# Altium project CopterControl.PrjPCB
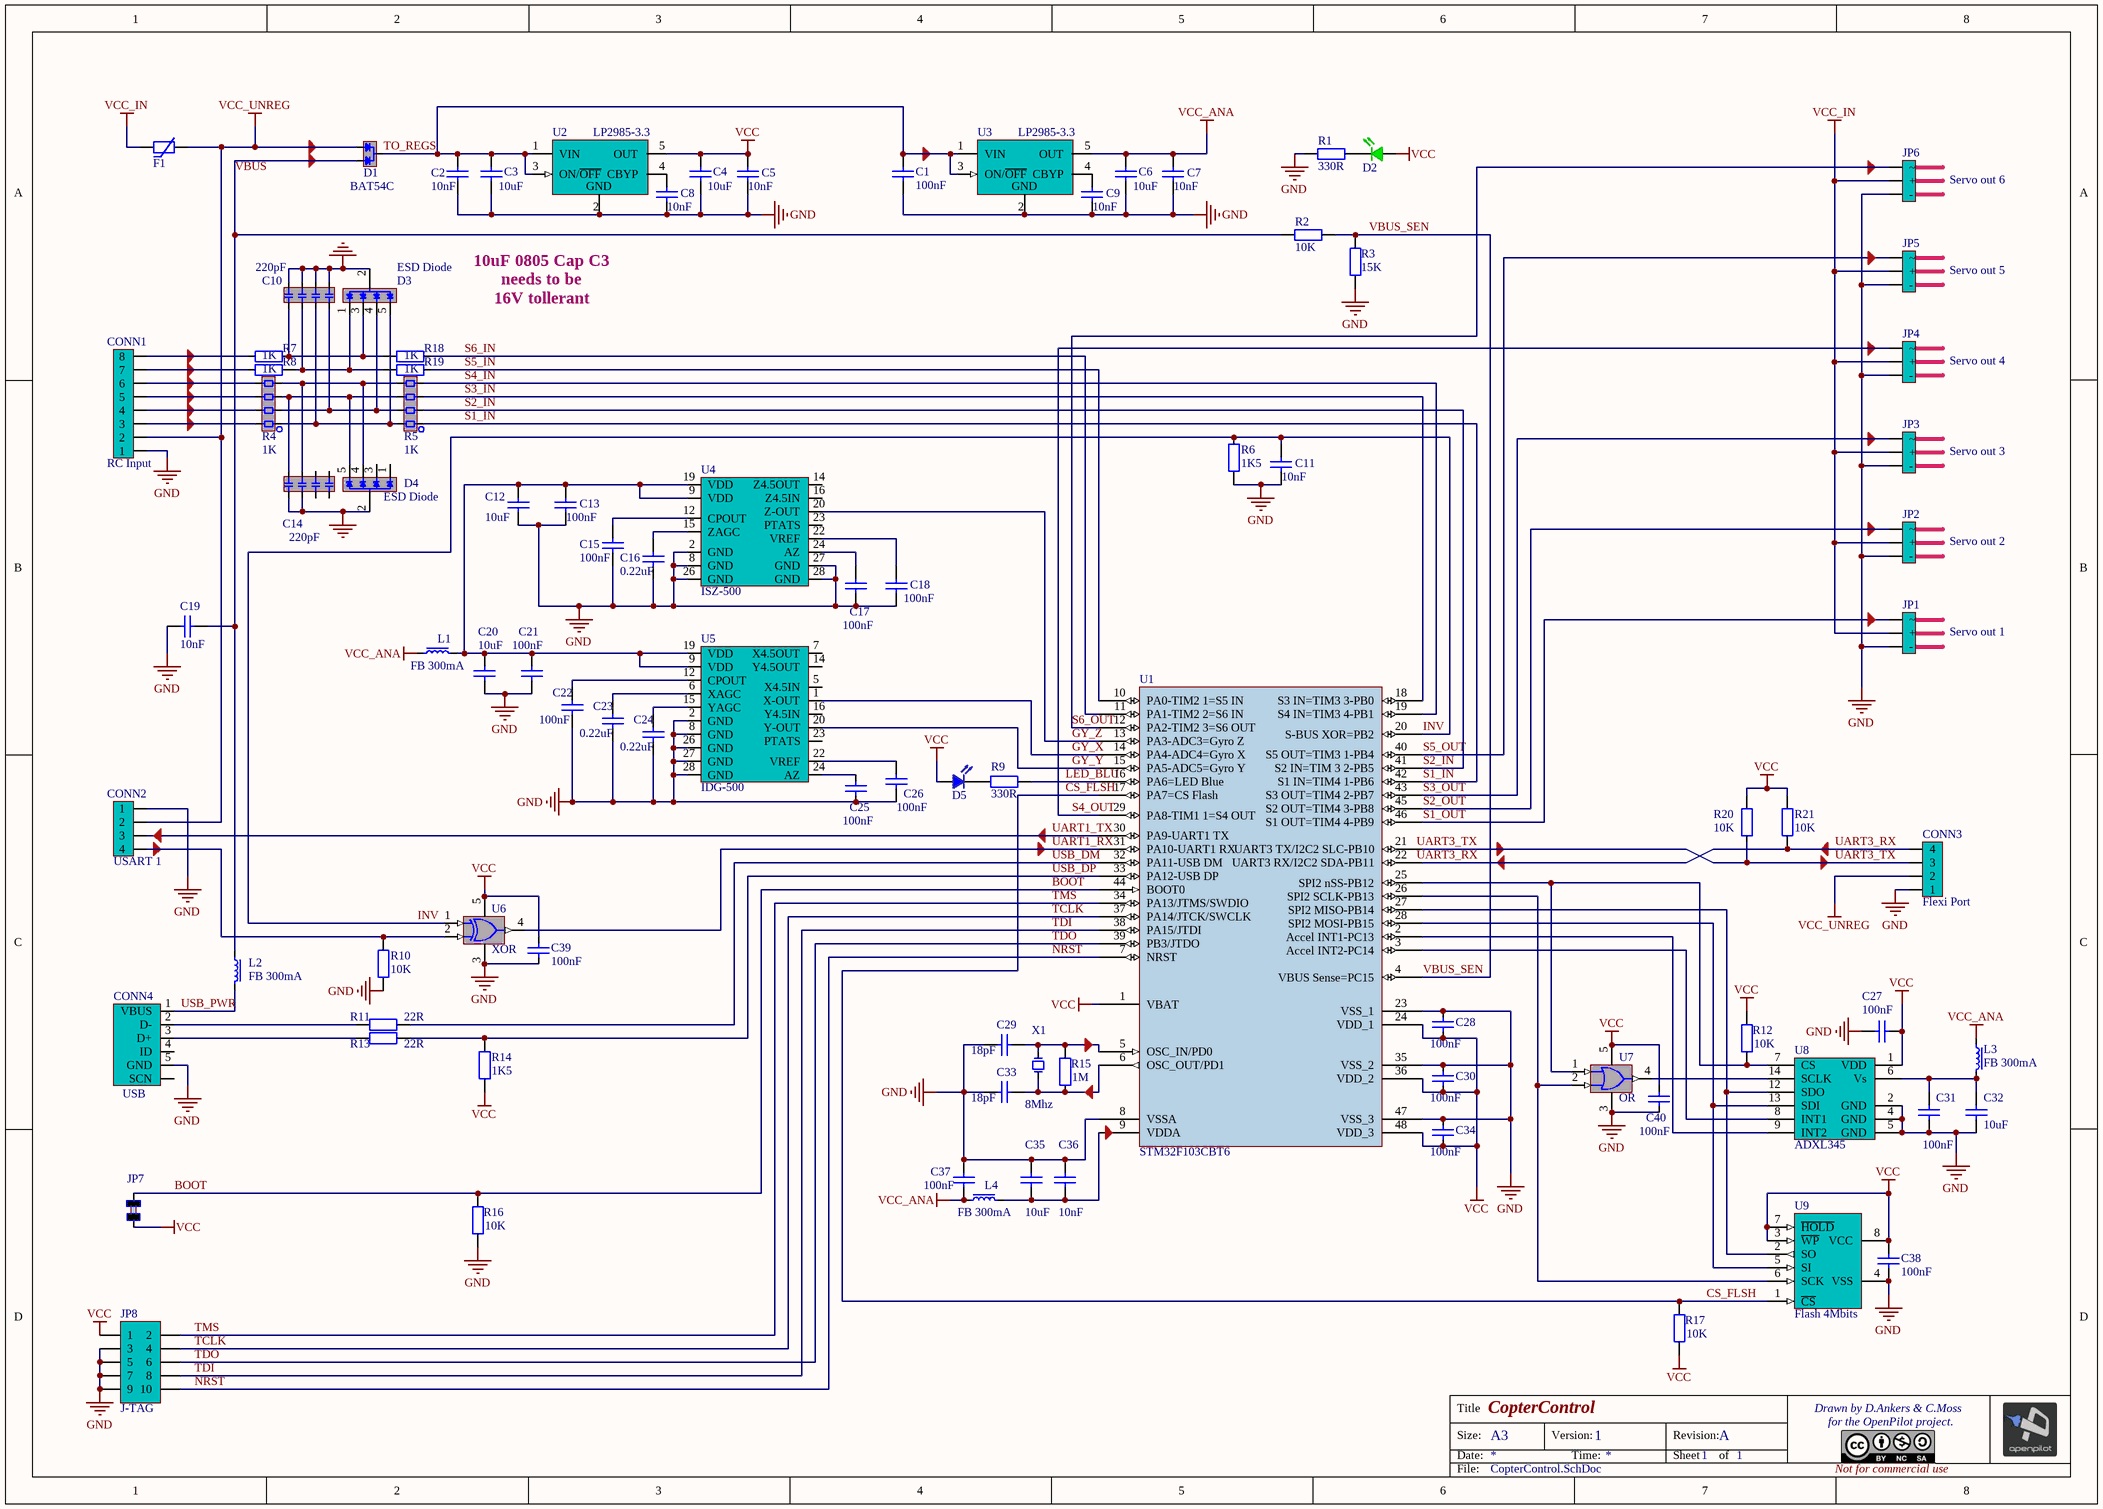
[diagram p0: CopterControl.SchDoc]
1 sheet, 93 parts. Net scope: global (net labels, ports and power ports of the same name join across sheets).
Board file: CopterControl.PcbDoc

## Sheet CopterControl.SchDoc: CopterControl
size A3; Author: David Ankers; DrawnBy: David Ankers; Engineer: David Ankers; Organization: The OpenPilot Project; DocumentNumber: 1; Revision: A; SheetNumber: 1; SheetTotal: 1; License: Creative Commons BY-NC-SA Non commercial use only; ProjectName: OpenPilot

### Parts
C1  value 100nF  [CAP603N]  (hidden comment: Cap603)
C2  value 10nF  [CAP603N]  (hidden comment: Cap603)
C3  value 10uF  [CAP805N]  (hidden comment: Cap805)
C4  value 10uF  [CAP805N]  (hidden comment: Cap805)
C5  value 10nF  [CAP603N]  (hidden comment: Cap603)
C6  value 10uF  [CAP805N]  (hidden comment: Cap805)
C7  value 10nF  [CAP603N]  (hidden comment: Cap603)
C8  value 10nF  [CAP603N]  (hidden comment: Cap603)
C9  value 10nF  [CAP603N]  (hidden comment: Cap603)
C10  value 220pF  [CAP ARRAY 0612]  (hidden comment: Cap Array 220pF)
C11  value 10nF  [CAP603N]  (hidden comment: Cap603)
C12  value 10uF  [CAP805N]  (hidden comment: Cap805)
C13  value 100nF  [CAP603N]  (hidden comment: Cap603)
C14  value 220pF  [CAP ARRAY 0612]  (hidden comment: Cap Array 220pF)
C15  value 100nF  [CAP603N]  (hidden comment: Cap603)
C16  value 0.22uF  [CAP603N]  (hidden comment: Cap603)
C17  value 100nF  [CAP603N]  (hidden comment: Cap603)
C18  value 100nF  [CAP603N]  (hidden comment: Cap603)
C19  value 10nF  [CAP603N]  (hidden comment: Cap603)
C20  value 10uF  [CAP805N]  (hidden comment: Cap805)
C21  value 100nF  [CAP603N]  (hidden comment: Cap603)
C22  value 100nF  [CAP603N]  (hidden comment: Cap603)
C23  value 0.22uF  [CAP603N]  (hidden comment: Cap603)
C24  value 0.22uF  [CAP603N]  (hidden comment: Cap603)
C25  value 100nF  [CAP603N]  (hidden comment: Cap603)
C26  value 100nF  [CAP603N]  (hidden comment: Cap603)
C27  value 100nF  [CAP603N]  (hidden comment: Cap603)
C28  value 100nF  [CAP603N]  (hidden comment: Cap603)
C29  value 18pF  [CAP603N]  (hidden comment: Cap603)
C30  value 100nF  [CAP603N]  (hidden comment: Cap603)
C31  value 100nF  [CAP603N]  (hidden comment: Cap603)
C32  value 10uF  [CAP805N]  (hidden comment: Cap805)
C33  value 18pF  [CAP603N]  (hidden comment: Cap603)
C34  value 100nF  [CAP603N]  (hidden comment: Cap603)
C35  value 10uF  [CAP805N]  (hidden comment: Cap805)
C36  value 10nF  [CAP603N]  (hidden comment: Cap603)
C37  value 100nF  [CAP603N]  (hidden comment: Cap603)
C38  value 100nF  [CAP603N]  (hidden comment: Cap603)
C39  value 100nF  [CAP603N]  (hidden comment: Cap603)
C40  value 100nF  [CAP603N]  (hidden comment: Cap603)
CONN1  RC Input  [JST SH 8 Pin Side Entry]
CONN2  USART 1  [JST SH 4 Pin Side Entry]
CONN3  Flexi Port  [JST SH 4 Pin Side Entry]
CONN4  USB  [USB SMD]
D1  BAT54C  [SOT23-3N]
D2  Green  [LED603N]  (value not drawn)
D3  ESD Diode  [SOT-353]
D4  ESD Diode  [SOT-353]
D5  Blue  [LED603N]  (value not drawn)
F1  MF-MSMF030-2  [PTC1812N]  (value not drawn)
JP1  Servo out 1  [SIP3 - 0.1]
JP2  Servo out 2  [SIP3 - 0.1]
JP3  Servo out 3  [SIP3 - 0.1]
JP4  Servo out 4  [SIP3 - 0.1]
JP5  Servo out 5  [SIP3 - 0.1]
JP6  Servo out 6  [SIP3 - 0.1]
JP7  2 PAD Touch JMP  [TOUCH JMP 2PAD - duplicate]  (value not drawn)
JP8  J-TAG  [JTAG Hdr 10-Pin]
L1  FB 300mA  [IND603N]
L2  FB 300mA  [IND603N]
L3  FB 300mA  [IND603N]
L4  FB 300mA  [IND603N]
R1  value 330R  [RES603N]  (hidden comment: Res603)
R2  value 10K  [RES603N]  (hidden comment: Res603)
R3  value 15K  [RES603N]  (hidden comment: Res603)
R4  value 1K  [TC164]  (hidden comment: Res Array 1K 1206)
R5  value 1K  [TC164]  (hidden comment: Res Array 1K 1206)
R6  value 1K5  [RES603N]  (hidden comment: Res603)
R7  value 1K  [RES603N]  (hidden comment: Res603)
R8  value 1K  [RES603N]  (hidden comment: Res603)
R9  value 330R  [RES603N]  (hidden comment: Res603)
R10  value 10K  [RES603N]  (hidden comment: Res603)
R11  value 22R  [RES603N]  (hidden comment: Res603)
R12  value 10K  [RES603N]  (hidden comment: Res603)
R13  value 22R  [RES603N]  (hidden comment: Res603)
R14  value 1K5  [RES603N]  (hidden comment: Res603)
R15  value 1M  [RES603N]  (hidden comment: Res603)
R16  value 10K  [RES603N]  (hidden comment: Res603)
R17  value 10K  [RES603N]  (hidden comment: Res603)
R18  value 1K  [RES603N]  (hidden comment: Res603)
R19  value 1K  [RES603N]  (hidden comment: Res603)
R20  value 10K  [RES603N]  (hidden comment: Res603)
R21  value 10K  [RES603N]  (hidden comment: Res603)
U1  STM32F103CBT6  [STM32 48 Lead]
U2  LP2985-3.3  [SOT23-5L]
U3  LP2985-3.3  [SOT23-5L]
U4  ISZ-500  [GYRO QFN-28]
U5  IDG-500  [GYRO QFN-28]
U6  XOR  [DCK-5]
U7  OR  [DCK-5]
U8  ADXL345  [ADXL345]
U9  Flash 4Mbits  [SOIC8_N]
X1  value 8Mhz  [XTAL ACT530SMX-4 Series]  (hidden comment: 8MHz SMD XTal)

### Nets
GND: C1.2 C2.2 C3.2 C4.2 C5.2 C6.2 C7.2 C8.2 C9.2 C10.5 C10.6 C10.7 C10.8 C11.2 C12.2 C13.2 C14.3 C14.4 C15.2 C16.2 C17.2 C18.2 C19.2 C20.2 C21.2 C22.2 C23.2 C24.2 C25.2 C26.2 C27.1 C28.1 C29.1 C30.1 C31.2 C32.2 C33.1 C34.1 C35.1 C36.1 C37.1 C38.2 C39.2 C40.1 CONN1.1 CONN2.1 CONN3.1 CONN4.5(GND) D3.2 D4.2 JP1.3(-) JP2.3(-) JP3.3(-) JP4.3(-) JP5.3(-) JP6.3(-) JP8.3 JP8.5 JP8.7 JP8.9 R1.1 R3.1 R6.1 R10.1 R16.1 U1.8(VSSA) U1.23(VSS_1) U1.35(VSS_2) U1.47(VSS_3) U2.2(GND) U3.2(GND) U4.2(GND) U4.8(GND) U4.26(GND) U4.27(GND) U4.28(GND) U5.2(GND) U5.8(GND) U5.26(GND) U5.27(GND) U5.28(GND) U6.3(GND) U7.3(GND) U8.2(GND) U8.4(GND) U8.5(GND) U9.4(VSS)
VCC: C4.1 C5.1 C27.2 C28.2 C30.2 C34.2 C38.1 C39.1 C40.2 D2.2(A) D5.2(A) JP7.2 JP8.1 R12.2 R14.1 R17.1 R20.2 R21.2 U1.1(VBAT) U1.24(VDD_1) U1.36(VDD_2) U1.48(VDD_3) U2.5(OUT) U6.5(VCC) U7.5(VCC) U8.1(VDD) U9.3(~{WP}) U9.7(~{HOLD}) U9.8(VCC)
VCC_ANA: C6.1 C7.1 C37.2 L1.1 L3.1 L4.1 U3.5(OUT)
VCC_IN: F1.2 JP1.2(+) JP2.2(+) JP3.2(+) JP4.2(+) JP5.2(+) JP6.2(+)
VCC_UNREG: CONN1.2 CONN2.2 CONN3.2 D1.2(A2) F1.1
BOOT: JP7.1 R16.2 U1.44(BOOT0)
CS_FLSH: R17.2 U1.17(PA7=CS_Flash) U9.1(~{CS})
GY_X: U1.14(PA4-ADC4=Gyro_X) U5.1(X-OUT)
GY_Y: U1.15(PA5-ADC5=Gyro_Y) U5.20(Y-OUT)
GY_Z: U1.13(PA3-ADC3=Gyro_Z) U4.20(Z-OUT)
INV: C11.1 R6.2 U1.20(S-BUS_XOR=PB2) U6.1(A)
LED_BLU: R9.2 U1.16(PA6=LED_Blue)
NRST: JP8.10 U1.7(NRST)
S1_IN: R5.1 U1.42(S1_IN=TIM4_1-PB6)
S1_OUT: JP1.1 U1.46(S1_OUT=TIM4_4-PB9)
S2_IN: R5.2 U1.41(S2_IN=TIM_3_2-PB5)
S2_OUT: JP2.1 U1.45(S2_OUT=TIM4_3-PB8)
S3_IN: R5.3 U1.18(S3_IN=TIM3_3-PB0)
S3_OUT: JP3.1 U1.43(S3_OUT=TIM4_2-PB7)
S4_IN: R5.4 U1.19(S4_IN=TIM3_4-PB1)
S4_OUT: JP4.1 U1.29(PA8-TIM1_1=S4_OUT)
S5_IN: R19.1 U1.10(PA0-TIM2_1=S5_IN)
S5_OUT: JP5.1 U1.40(S5_OUT=TIM3_1-PB4)
S6_IN: R18.1 U1.11(PA1-TIM2_2=S6_IN)
S6_OUT: JP6.1 U1.12(PA2-TIM2_3=S6_OUT)
TCLK: JP8.4 U1.37(PA14/JTCK/SWCLK)
TDI: JP8.8 U1.38(PA15/JTDI)
TDO: JP8.6 U1.39(PB3/JTDO)
TMS: JP8.2 U1.34(PA13/JTMS/SWDIO)
TO_REGS: C1.1 C2.1 C3.1 D1.3(COM) U2.1(VIN) U2.3(ON/~{OFF}) U3.1(VIN) U3.3(ON/~{OFF})
UART1_RX: U1.31(PA10-UART1_RX) U6.4(Y)
UART1_TX: CONN2.3 U1.30(PA9-UART1_TX)
UART3_RX: CONN3.4 R21.1 U1.22(UART3_RX/I2C2_SDA-PB11)
UART3_TX: CONN3.3 R20.1 U1.21(UART3_TX/I2C2_SLC-PB10)
USB_DM: R11.1 U1.32(PA11-USB_DM)
USB_DP: R13.1 R14.2 U1.33(PA12-USB_DP)
USB_PWR: CONN4.1(VBUS) L2.2
VBUS: C19.1 D1.1(A1) L2.1 R2.1
VBUS_SEN: R2.2 R3.2 U1.4(VBUS_Sense=PC15)
NetC8_1: C8.1 U2.4(CBYP)
NetC9_1: C9.1 U3.4(CBYP)
NetC10_1: C10.1 D3.3 R7.1 R18.2
NetC10_2: C10.2 D3.1 R8.1 R19.2
NetC10_3: C10.3 D3.5 R4.1 R5.8
NetC10_4: C10.4 D3.4 R4.2 R5.7
NetC12_1: C12.1 C13.1 C20.1 C21.1 L1.2 U4.9(VDD) U4.19(VDD) U5.9(VDD) U5.19(VDD)
NetC14_5: C14.5 D4.5 R4.3 R5.6
NetC14_6: C14.6 D4.4 R4.4 R5.5
NetC15_1: C15.1 U4.12(CPOUT)
NetC16_1: C16.1 U4.15(ZAGC)
NetC17_1: C17.1 U4.24(AZ)
NetC18_1: C18.1 U4.22(VREF)
NetC22_1: C22.1 U5.12(CPOUT)
NetC23_1: C23.1 U5.6(XAGC)
NetC24_1: C24.1 U5.15(YAGC)
NetC25_1: C25.1 U5.24(AZ)
NetC26_1: C26.1 U5.22(VREF)
NetC29_2: C29.2 R15.2 U1.5(OSC_IN/PD0) X1.3
NetC31_1: C31.1 C32.1 L3.2 U8.6(Vs)
NetC33_2: C33.2 R15.1 U1.6(OSC_OUT/PD1) X1.1
NetC35_2: C35.2 C36.2 L4.2 U1.9(VDDA)
NetCONN1_3: CONN1.3 R4.8
NetCONN1_4: CONN1.4 R4.7
NetCONN1_5: CONN1.5 R4.6
NetCONN1_6: CONN1.6 R4.5
NetCONN1_7: CONN1.7 R8.2
NetCONN1_8: CONN1.8 R7.2
NetCONN2_4: CONN2.4 R10.2 U6.2(B)
NetCONN4_2: CONN4.2(D-) R11.2
NetCONN4_3: CONN4.3(D+) R13.2
NetD2_1: D2.1(K) R1.2
NetD5_1: D5.1(K) R9.1
NetR12_1: R12.1 U1.25(SPI2_nSS-PB12) U7.1(A) U8.7(CS)
NetU1_2: U1.2(Accel_INT1-PC13) U8.9(INT2)
NetU1_3: U1.3(Accel_INT2-PC14) U8.8(INT1)
NetU1_26: U1.26(SPI2_SCLK-PB13) U7.2(B) U9.6(SCK)
NetU1_27: U1.27(SPI2_MISO-PB14) U8.12(SDO) U9.2(SO)
NetU1_28: U1.28(SPI2_MOSI-PB15) U8.13(SDI) U9.5(SI)
NetU7_4: U7.4(Y) U8.14(SCLK)

Not connected (* = marked no-connect by the designer): C14 1 2 7 8; CONN4 0(SCN) 4(ID); D4 1 3; U4 0(Heat_Pad) 1(NC) 3(NC) 4(NC) 5(NC) 6(NC) 7(NC) 10 11 13 14(Z4.5OUT) 16(Z4.5IN) 17(NC) 18(NC) 21 23(PTATS) 25; U5 0 3 4 5(X4.5IN) 7(X4.5OUT) 10 11 13 14(Y4.5OUT) 16(Y4.5IN) 17 18 21 23(PTATS) 25; U8 3(RESV) 10(NC) 11(RESV)

### Notes on the sheet
- 10uF 0805 Cap C3
  needs to be
  16V tollerant
- Title
- Size:
- Date:
- A3
- Version:
- Time:
- Revision:
- Sheet
- of
- Drawn by D.Ankers & C.Moss
- for the OpenPilot project.
- File:
- Not for commercial use
- Labels drawn without touching a wire or pin: UART3_RX, UART3_TX

### Library data of the parts
C1 C2 C5 C7-C9 C11 C13 C15-C19 C21-C31 C33 C34 C36-C40 = Cap603: Capacitor SMD; Published: 1-Nov-2010; LatestRevisionDate: 1-Nov-2010; LatestRevisionNote: Released OpenPilot Lib; PackageReference: 0603 (1608 Metric); Publisher: The OpenPilot Project; Supplier 1: Digi-Key
  C1 C13 C15 C17 C18 C21 C22 C25-C28 C30 C31 C34 C37-C40: Supplier Part Number 1: 399-5089-1-ND
  C2 C5 C7-C9 C11 C19 C36: Supplier Part Number 1: 399-1091-1-ND
  C16 C23 C24: Supplier Part Number 1: 490-1535-1-ND
  C29 C33: Supplier Part Number 1: 399-1052-1-ND
C3 C4 C6 C12 C20 C32 C35 = Cap805: Capacitor SMD; Published: 1-Nov-2010; LatestRevisionDate: 1-Nov-2010; LatestRevisionNote: Released OpenPilot Lib; PackageReference: 0805 (2012 Metric); Publisher: The OpenPilot Project; Supplier 1: Digi-Key; Supplier Part Number 1: 490-3886-1-ND
C10 C14 = Cap Array 220pF: Capacitor array, 4 * 220pF; Manufacturer: Generic Components; Class: Passive; Supplier 1: Digi-Key; Supplier Part Number 1: 478-2882-1-ND
CONN1 = JST-SH 8-pin Side Entry Socket: Manufacturer: Generic Components; Class: Connector; Supplier 1: Digi-Key; Supplier Part Number 1: 455-1808-1-ND
CONN2 CONN3 = JST-SH 4-pin Side Entry Socket: Manufacturer: Generic Components; Class: Connector; Supplier 1: Digi-Key; Supplier Part Number 1: 455-1804-1-ND
CONN4 = USB_SMT_B: USB Type-B SMT Socket; Class: Connector; Supplier 1: Digi-Key; Supplier Part Number 1: 670-1190-1-ND
D1 = BAT54C: Dual Diode Command Cathode; Supplier 1: Digi-Key; Supplier Part Number 1: BAT54CCT-ND
D2 = LED 603 Gr: Green 603 LED; Value: 2.1v 20mA; Supplier 1: Digi-Key; Supplier Part Number 1: 754-1116-1-ND
D3 D4 = Quad ESD Diode 3.3V: Quad ESD Protection, 3.3V, PESD3V3L4UG,115; Supplier 1: Digi-Key; Supplier Part Number 1: 568-4042-1-ND
D5 = LED 603 Bl: Blue 603 LED; Value: 2.1v 20mA; Supplier 1: Digi-Key; Supplier Part Number 1: 754-1119-1-ND
F1 = PTC 30V 10A SMD: Supplier 1: Digi-Key; Supplier Part Number 1: MF-MSMF030-2CT-ND
JP1-JP6 = Hdr 3 Pin 0.1: Header, 3-Pin, 0.1"; Manufacturer: Generic Components; Class: Connector; Supplier 1: Digi-Key; Supplier Part Number 1: MTLW-103-23-S-S-260-ND
JP7 = 2 PAD Touch JMP: 2 Pad Touch Jumper; LatestRevisionDate: 1-Nov-2010; LatestRevisionNote: Released OpenPilot Lib; Published: 1-Nov-2010; Publisher: The OpenPilot Project
JP8 = J-TAG Connector: Header, 5-Pin, Dual row; Manufacturer: Generic Components; Class: Connector; Supplier 1: Digi-Key; Supplier Part Number 1: S9012E-05-ND
L1-L4 = FerriteBead_300mA: Ferrite Bead 300mA; Manufacturer: Generic Components; Class: Passive; Supplier 1: Digi-Key; Supplier Part Number 1: 732-1586-1-ND
R1-R3 R6-R21 = Res603: Resistor SMD; Published: 1-Nov-2010; LatestRevisionDate: 1-Nov-2010; LatestRevisionNote: Released OpenPilot Lib; PackageReference: 0402 (1005 Metric); Publisher: The OpenPilot Project; Supplier 1: Digi-Key
  R1 R9: Supplier Part Number 1: RHM330HCT-ND
  R2 R10 R12 R16 R17 R20 R21: Supplier Part Number 1: P10.0KHCT-ND
  R3: Supplier Part Number 1: P15.0KHCT-ND
  R6 R14: Supplier Part Number 1: P1.50KHCT-ND
  R7 R8 R18 R19: Supplier Part Number 1: P1.00KHCT-ND
  R11 R13: Supplier Part Number 1: P22GCT-ND
  R15: Supplier Part Number 1: P1.0MGCT-ND
R4 R5 = Res Array 1K: 4 Resistor Array; Class: Passive; SubClass: Resistor; Supplier 1: Digi-Key; Supplier Part Number 1: TC164J-1.0KCT-ND
U1 = STM32F103CBT6: STM32 ARM-based 32-bit MCU with 128 Kbytes Flash, 48-pin LQFP, Industrial Temperature; Published: 30-May-2008; DatasheetVersion: rev6, Mar-2008; PackageVersion: Mar-2008; PackageReference: LQFP48; Publisher: Altium Limited; PackageDescription: 48-Pin Low-Profile Quad Flat Pack, 7 x 7 mm Body, 0.5 mm Pitch (LQFP48); ComponentLink1Description: Manufacturer Link; ComponentLink1URL: www.st.com/stm32; ComponentLink2Description: Datasheet; ComponentLink2URL: http://www.st.com/stonline/products/literature/ds/13587.pdf; Supplier 1: Digi-Key; Supplier Part Number 1: 497-6288-ND
U2 U3 = LP2985-3.3: 3.3V 150mA LDO Regulator; Supplier 1: Digi-Key; Supplier Part Number 1: 296-18479-1-ND
U4 = Gyro ISZ-500: Invensense ISZ-500 Z Axis Gyro
U5 = Gyro IDG-500: Invensense IDG-500 XY Axis Gyro
U6 = XOR SN74LVC1G86DCKR: XOR Gate SN74LVC1G86DCKR; Supplier 1: Digi-Key; Supplier Part Number 1: 296-9854-1-ND
U7 = OR SN74AHC1G32DCKR: OR Gate SN74AHC1G32DCKR; Supplier 1: Digi-Key; Supplier Part Number 1: 296-8749-1-ND
U8 = Accel ADXL345: Analog Devices ADXL345 Accel; Supplier 1: Digi-Key; Supplier Part Number 1: ADXL345BCCZ-RL7CT-ND
U9 = Flash W25X40BVSNIG: 4Mbit SPI Flash Memory; ComponentLink2Description: Datasheet; LatestRevisionDate: 1-Nov-2010; LatestRevisionNote: Released OpenPilot Lib; Published: 1-Nov-2010; Publisher: The OpenPilot Project; Supplier 1: Digi-Key; Supplier Part Number 1: W25X40BVSNIG-ND
X1 = XTAL ACT530SMX-4: SMD Quartz Crystal 8Mhz; Class: Oscillator; SubClass: Crystal Oscillator; Supplier 1: Digi-Key; Supplier Part Number 1: 535-9720-1-ND